# Altium schematic sheet CAN1.SchDoc
size A4
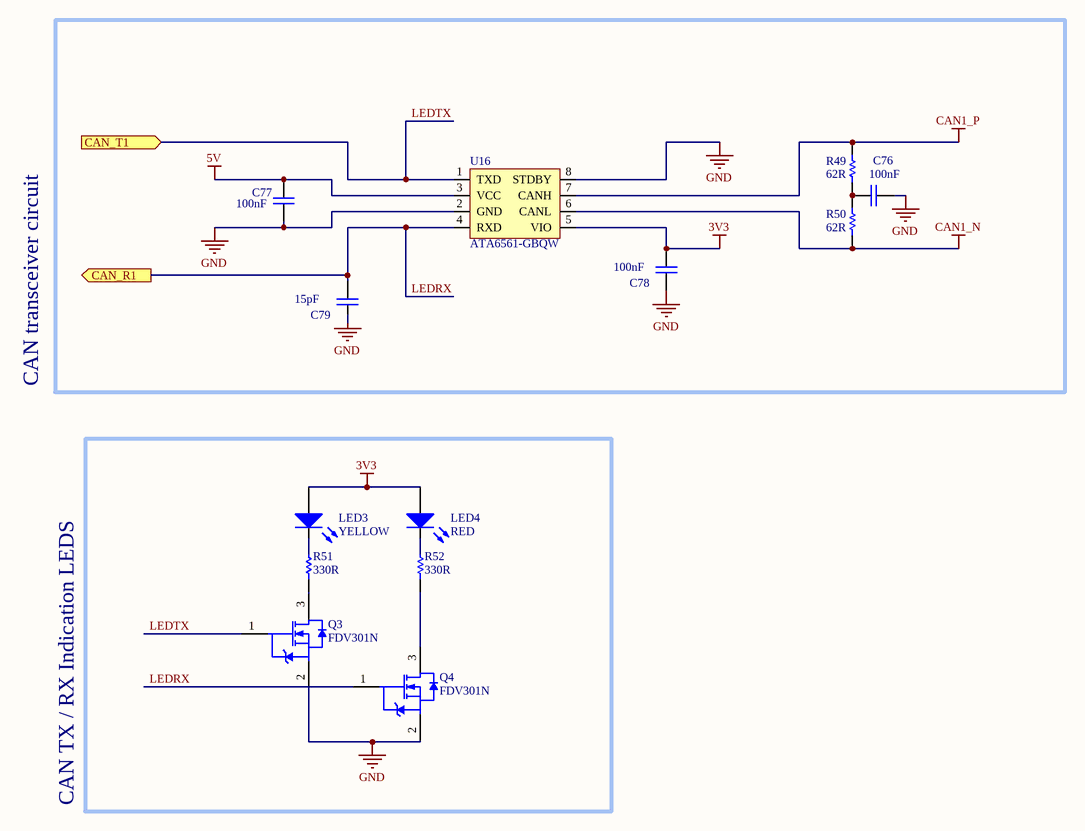
[diagram p0: CAN1.SchDoc]

## Parts
C76  value 100nF  [C1206]  (hidden comment: C1206C106K3PACTU)
C77  value 100nF  [C1206]  (hidden comment: C1206C106K3PACTU)
C78  value 100nF  [C1206]  (hidden comment: C1206C106K3PACTU)
C79  value 15pF  [C1206]  (hidden comment: C1206C106K3PACTU)
LED3  YELLOW  [0603_A]
LED4  RED  [0603_A]
Q3  FDV301N  [FAIR-SOT23-3_V]
Q4  FDV301N  [FAIR-SOT23-3_V]
R49  62R  [RESC0603(1608)_L]
R50  62R  [RESC0603(1608)_L]
R51  330R  [RESC0603(1608)_L]
R52  330R  [RESC0603(1608)_L]
U16  ATA6561-GBQW  [LME49721MA/NOPB]

## Ports
CAN_R1 (out), CAN_T1 (in)

## Nets
3V3: C78.2 LED3.2(A) LED4.2(A) U16.5(VIO)
5V: C77.2 U16.3(VCC)
CAN1_N: R50.2 U16.6(CANL)
CAN1_P: R49.1 U16.7(CANH)
GND: C76.1 C77.1 C78.1 C79.1 Q3.2(S) Q4.2(S) U16.2(GND) U16.8(STDBY)
LEDRX: C79.2 Q4.1(G) U16.4(RXD) ; port CAN_R1
LEDTX: Q3.1(G) U16.1(TXD) ; port CAN_T1
NetC76_2: C76.2 R49.2 R50.1
NetLED3_1: LED3.1(K) R51.1
NetLED4_1: LED4.1(K) R52.1
NetQ3_3: Q3.3(D) R51.2
NetQ4_3: Q4.3(D) R52.2

## Notes on the sheet
- CAN transceiver circuit
- CAN TX / RX Indication LEDS

## Library data of the parts
C76-C79 = C1206C106K3PACTU: C1206
LED3 LED4 = CMP-1426-00001-1: SMD mono-color Chip LED, WL-SMCW, Red; Manufacturer: Wuerth Elektronik; PartNumber: 150060RS75000; Color: Red; PackageReference: 0603_A; ComponentLink2URL: http://katalog.we-online.com/led/datasheet/150060RS75000.pdf; ComponentLink1URL: http://www.we-online.com; ComponentLink1Description: Manufacturer URL; ComponentLink2Description: Datasheet
Q3 Q4 = CMP-2000-04935-1: Digital FET, N-Channel, 0.35 W, 25 V, -55 to 150 degC, 3-Pin SOT23, RoHS, Tape and Reel; Manufacturer: Fairchild; Rds(on) Test Voltage Vgs: 2.7V; Threshold Voltage Vgs Typ: 850mV; Voltage Vds Typ: 25V; Transistor Case Style: SOT-23; Reel Quantity: 3000; Voltage Vgs Rds on Measurement: 4.5V; Power Dissipation Pd: 350mW; Continuous Drain Current Id: 220mA; Transistor Polarity: NChannel; No. of Transistors: 1; Package Version: Rev. 12, 03/2016; Voltage Vgs th Max: 1.5V; ESD HBM: 6kV; Pulse Current Idm: 500mA; Current Temperature: 25degC; On Resistance Rds(on): 5ohm; External Depth: 2.5mm; SMD Marking: 301; No. of Pins: 3; External Width: 3.05mm; SVHC: NoSVHC(19-Dec-2012); External Length / Height: 1.12mm; Termination Type: SMD; Package Reference: SOT23-3; Package URL: http://www.fairchildsemi.com/dwg/MA/MA03D.pdf; Voltage Vgs Max: 850mV; Drain Source Voltage Vds: 25V; Operating Temperature Max: 150degC; Package Description: 3-Pin Small Outline Transistor, Body 2.92 x 1.325 mm, Pitch 0.95 mm; Operating Temperature Min: -55degC; Datasheet Version: Jun-09; Tape Width: 8mm; Full Power Rating Temperature: 25degC; Datasheet URL: https://datasheet.ciiva.com/8114/fdv301n-8114688.pdf; Package / Case: SOT-23; Manufacturer URL: https://www.fairchildsemi.com/; Current Id Max: 220mA; Operating Temperature Range: -55degCto+150degC
R49-R52 = CMP-1012-00062-1: 330R 0.1W 5% 0603 (1608 Metric)  SMD; Value: 330.00 Ohm; Case-EIA: 0603; Case-Metric: 1608; Tolerance: 5 %; Power: 0.1 W; Technology: SMT